# EAGLE design OMHOT (EAGLE 9.5.1)

## Sheet 1 of 2
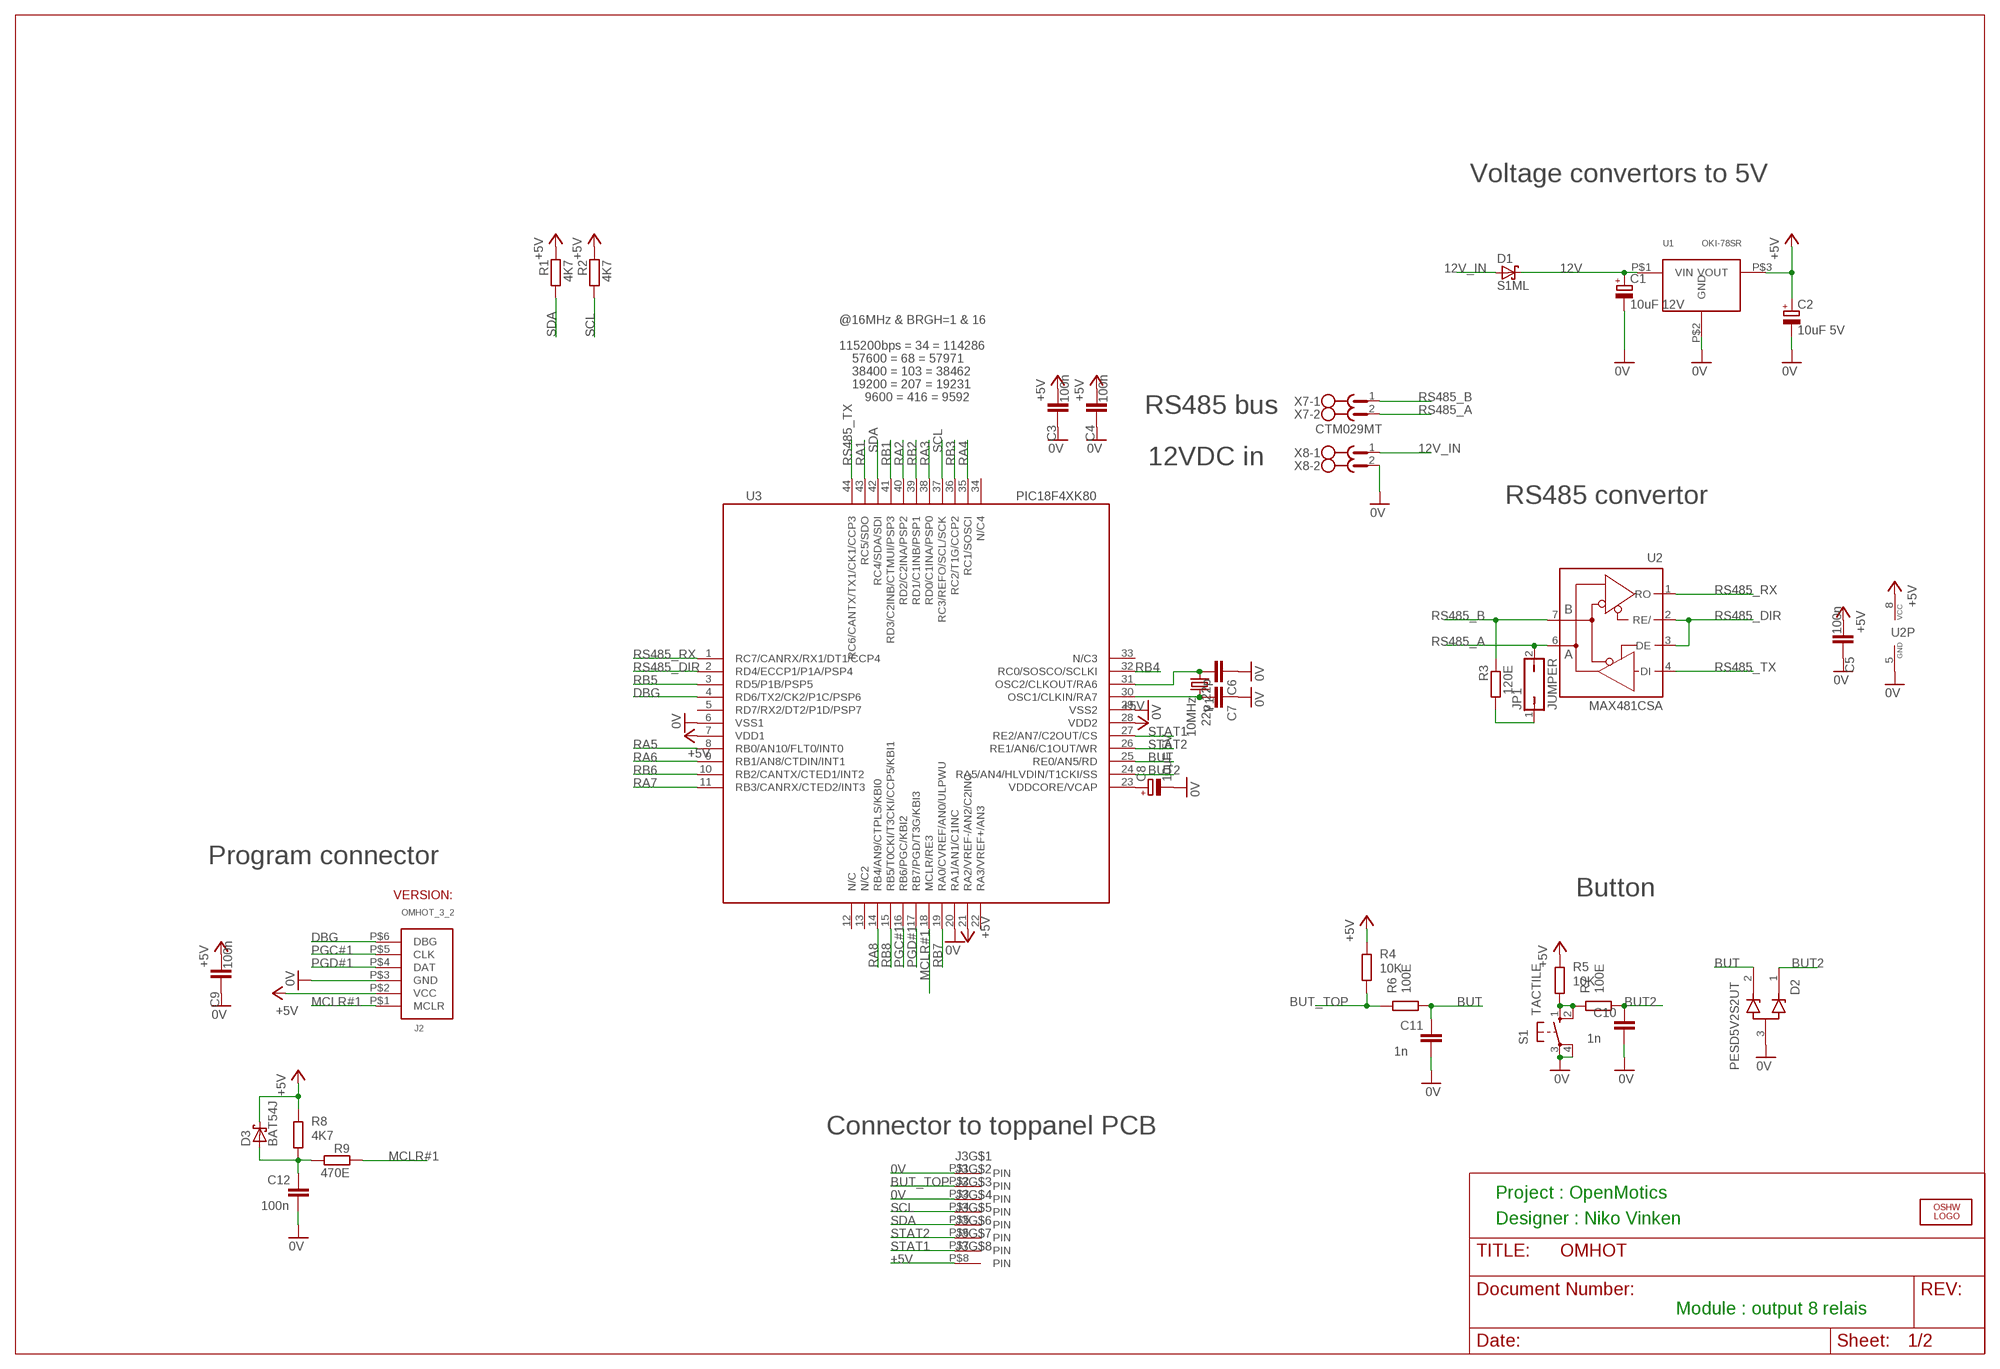
[diagram p0: schematic, sheet 1]

### Parts
C1  10uF 12V  CPOL-EU085CS-1AR  [085CS_1AR]
C2  10uF 5V  CPOL-EU085CS-1AR  [085CS_1AR]
C3  100n  C-EUC0603  [C0603]
C4  100n  C-EUC0603  [C0603]
C5  100n  C-EUC0603  [C0603]
C6  22p  C-EUC0603  [C0603]
C7  22p  C-EUC0603  [C0603]
C8  10uF 5V  CPOL-EU085CS-1AR  [085CS_1AR]
C9  100n  C-EUC0603  [C0603]
C10  1n  C-EUC0603  [C0603]
C11  1n  C-EUC0603  [C0603]
C12  100n  C-EUC0603  [C0603]
D1  S1ML  SMF5.0AT1  [SOD123FL]
D2  PESD5V2S2UT  PESD3V3S2UAT  [SOT23]
D3  BAT54J  [SOD323_REFLOW]
J2  PROG_CON  [PROG_CON_WITH_VERSION]
J3  8PIN_CON_AMP  [8PIN_CON_AMP]
JP1  JUMPER  JP1Q  [JP1]
LOGO2  OSHW_LOGO_FILLX0150-NT  [OSHW_FILLX150_NOTEXT]
R1  4K7  R-EU_R0603  [R0603]
R2  4K7  R-EU_R0603  [R0603]
R3  120E  R-EU_R1206  [R1206]
R4  10K  R-EU_R0603  [R0603]
R5  10K  R-EU_R0603  [R0603]
R6  100E  R-EU_R0603  [R0603]
R7  100E  R-EU_R0603  [R0603]
R8  4K7  R-EU_R0603  [R0603]
R9  470E  R-EU_R0603  [R0603]
S1  TACTILE  10-XX  [B3F-10XX]
U1  OKI-78SR  [OKI-78SR]
U2  MAX481CSA  [SO08]
U3  PIC18F4XK80  [TQFP44]
X7  CTM029MT  [CTM029MT]
X8  CTM029MT  [CTM029MT]
Y1  10MHz  CRYSTALSM49  [SM49]

### Nets
0V: C1.- C2.- C3.2 C4.2 C5.2 C6.1 C7.1 C8.- C9.2 C10.1 C11.1 C12.1 D2.3 J2.P$3(GND) J3.P$1 J3.P$3 S1.3(P) S1.4(P1) U1.P$2(GND) U2.5(GND) U3.6(VSS1) U3.20(RA1/AN1/C1INC) U3.29(VSS2) X8.2 ; also sheet 2
12V: C1.+ D1.C U1.P$1(VIN)
12V_IN: D1.A X8.1
+5V: C2.+ C3.1 C4.1 C5.1 C9.1 D3.1 J2.P$2(VCC) J3.P$8 R1.1 R2.1 R4.2 R5.2 R8.2 U1.P$3(VOUT) U2.8(VCC) U3.7(VDD1) U3.21(RA2/VREF-/AN2/C2INC) U3.28(VDD2) ; also sheet 2
BUT: C11.2 D2.2 R6.1 U3.25(RE0/AN5/RD)
BUT2: C10.2 D2.1 R7.1 U3.24(RA5/AN4/HLVDIN/T1CKI/SS)
BUT3: R5.1 R7.2 S1.1(S) S1.2(S1)
BUT_TOP: J3.P$2 R4.1 R6.2
DBG: J2.P$6(DBG) U3.4(RD6/TX2/CK2/P1C/PSP6)
MCLR#1: J2.P$1(MCLR) R9.1 U3.18(MCLR/RE3)
N$30: C6.2 U3.31(OSC2/CLKOUT/RA6) Y1.1
N$32: C7.2 U3.30(OSC1/CLKIN/RA7) Y1.2
N$33: C8.+ U3.23(VDDCORE/VCAP)
N$36: JP1.1 R3.2
N$444: C12.2 D3.2 R8.1 R9.2
PGC#1: J2.P$5(CLK) U3.16(RB6/PGC/KBI2)
PGD#1: J2.P$4(DAT) U3.17(RB7/PGD/T3G/KBI3)
RA1: U3.43(RC5/SDO) ; also sheet 2
RA2: U3.40(RD2/C2INA/PSP2) ; also sheet 2
RA3: U3.38(RD0/C1INA/PSP0) ; also sheet 2
RA4: U3.35(RC1/SOSCI) ; also sheet 2
RA5: U3.8(RB0/AN10/FLT0/INT0) ; also sheet 2
RA6: U3.9(RB1/AN8/CTDIN/INT1) ; also sheet 2
RA7: U3.11(RB3/CANRX/CTED2/INT3) ; also sheet 2
RA8: U3.14(RB4/AN9/CTPLS/KBI0) ; also sheet 2
RB1: U3.41(RD3/C2INB/CTMUI/PSP3) ; also sheet 2
RB2: U3.39(RD1/C1INB/PSP1) ; also sheet 2
RB3: U3.36(RC2/T1G/CCP2) ; also sheet 2
RB4: U3.32(RC0/SOSCO/SCLKI) ; also sheet 2
RB5: U3.3(RD5/P1B/PSP5) ; also sheet 2
RB6: U3.10(RB2/CANTX/CTED1/INT2) ; also sheet 2
RB7: U3.19(RA0/CVREF/AN0/ULPWU) ; also sheet 2
RB8: U3.15(RB5/T0CKI/T3CKI/CCP5/KBI1) ; also sheet 2
RS485_A: JP1.2 U2.6(A) X7.2
RS485_B: R3.1 U2.7(B) X7.1
RS485_DIR: U2.2(RE/) U2.3(DE) U3.2(RD4/ECCP1/P1A/PSP4)
RS485_RX: U2.1(RO) U3.1(RC7/CANRX/RX1/DT1/CCP4)
RS485_TX: U2.4(DI) U3.44(RC6/CANTX/TX1/CK1/CCP3)
SCL: J3.P$4 R2.2 U3.37(RC3/REFO/SCL/SCK)
SDA: J3.P$5 R1.2 U3.42(RC4/SDA/SDI)
STAT1: J3.P$7 U3.27(RE2/AN7/C2OUT/CS)
STAT2: J3.P$6 U3.26(RE1/AN6/C1OUT/WR)
Unconnected: U3.5(RD7/RX2/DT2/P1D/PSP7) U3.12(N/C) U3.13(N/C2) U3.22(RA3/VREF+/AN3) U3.33(N/C3) U3.34(N/C4)

### Notes on the sheet
- Voltage convertors to 5V
- @16MHz & BRGH=1 & 16
- 115200bps = 34 = 114286
- 57600 = 68 = 57971
- 38400 = 103 = 38462
- 19200 = 207 = 19231
- 9600 = 416 = 9592
- RS485 bus
- 12VDC in
- RS485 convertor
- Program connector
- Button
- Connector to toppanel PCB
- Project : OpenMotics
- Designer : Niko Vinken
- Module : output 8 relais

## Sheet 2 of 2
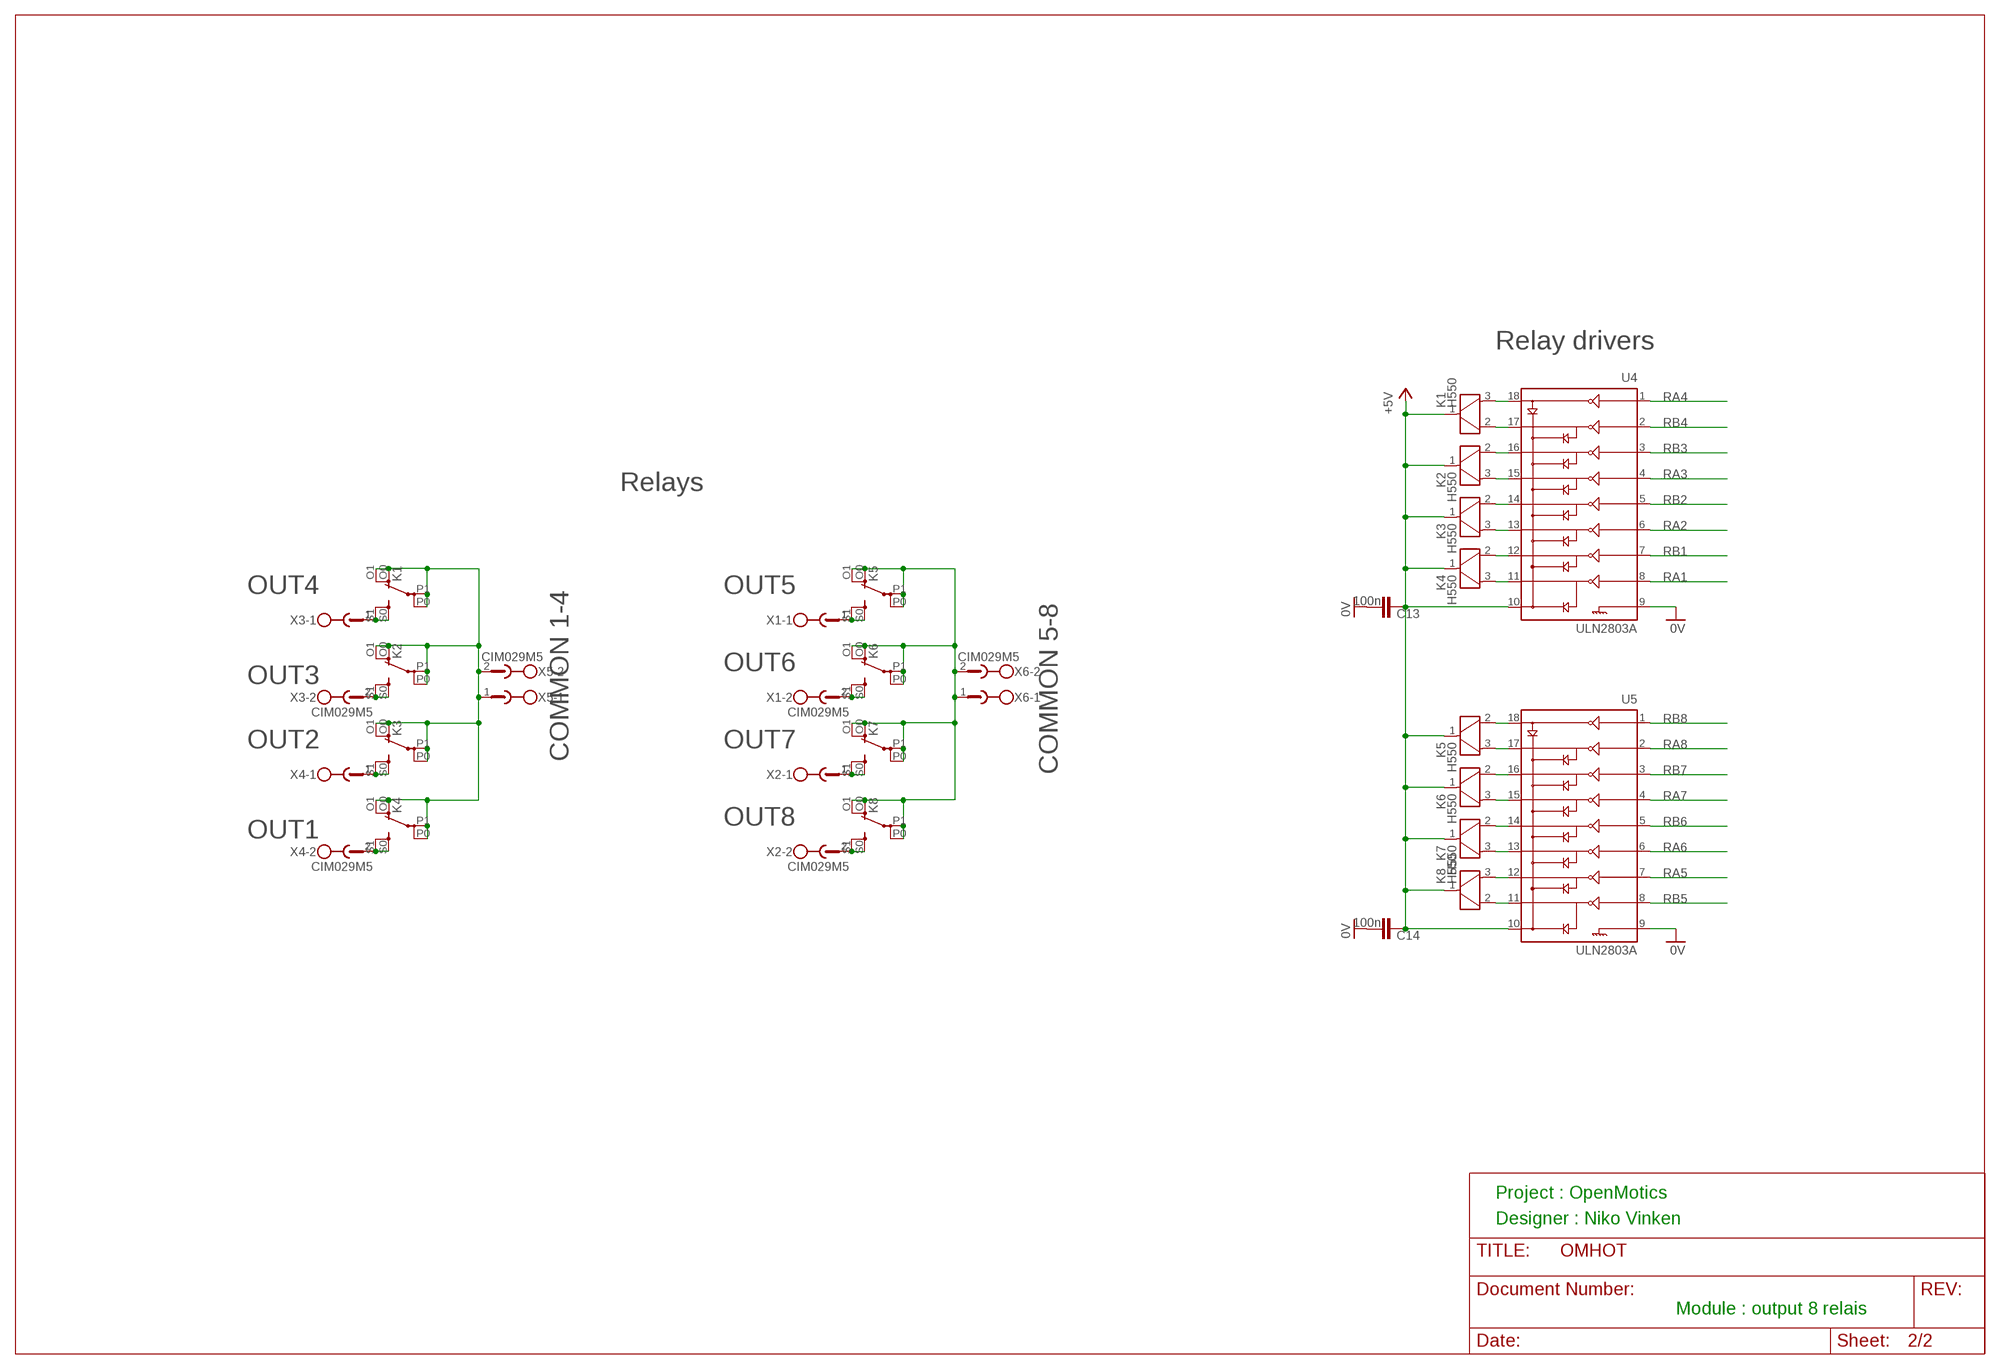
[diagram p1: schematic, sheet 2]

### Parts
C13  100n  C-EUC0603  [C0603]
C14  100n  C-EUC0603  [C0603]
K1  H550  [H550]
K2  H550  [H550]
K3  H550  [H550]
K4  H550  [H550]
K5  H550  [H550]
K6  H550  [H550]
K7  H550  [H550]
K8  H550  [H550]
U4  ULN2803A  [SOIC18]
U5  ULN2803A  [SOIC18]
X1  CIM029M5  [CIM029M5]
X2  CIM029M5  [CIM029M5]
X3  CIM029M5  [CIM029M5]
X4  CIM029M5  [CIM029M5]
X5  CIM029M5  [CIM029M5]
X6  CIM029M5  [CIM029M5]

### Nets
0V: C13.1 C14.1 U4.9 U5.9 ; also sheet 1
+5V: C13.2 C14.2 K1.1 K2.1 K3.1 K4.1 K5.1 K6.1 K7.1 K8.1 U4.10 U5.10 ; also sheet 1
N$1: K5.S0(2:S) K5.S1(2:S) X1.1
N$3: K3.S0(2:S) K3.S1(2:S) X4.1
N$4: K4.S0(2:S) K4.S1(2:S) X4.2
N$5: K6.S0(2:S) K6.S1(2:S) X1.2
N$6: K4.3 U4.11
N$7: K4.2 U4.12
N$8: K1.S0(2:S) K1.S1(2:S) X3.1
N$9: K3.3 U4.13
N$10: K7.S0(2:S) K7.S1(2:S) X2.1
N$11: K8.S0(2:S) K8.S1(2:S) X2.2
N$12: K1.O0(2:O) K1.O1(2:O) K1.P0(2:P) K1.P1(2:P) K2.O0(2:O) K2.O1(2:O) K2.P0(2:P) K2.P1(2:P) K3.O0(2:O) K3.O1(2:O) K3.P0(2:P) K3.P1(2:P) K4.O0(2:O) K4.O1(2:O) K4.P0(2:P) K4.P1(2:P) X5.1 X5.2
N$13: K2.S0(2:S) K2.S1(2:S) X3.2
N$14: K3.2 U4.14
N$15: K2.3 U4.15
N$16: K2.2 U4.16
N$17: K1.3 U4.18
N$18: K1.2 U4.17
N$19: K5.3 U5.17
N$20: K5.O0(2:O) K5.O1(2:O) K5.P0(2:P) K5.P1(2:P) K6.O0(2:O) K6.O1(2:O) K6.P0(2:P) K6.P1(2:P) K7.O0(2:O) K7.O1(2:O) K7.P0(2:P) K7.P1(2:P) K8.O0(2:O) K8.O1(2:O) K8.P0(2:P) K8.P1(2:P) X6.1 X6.2
N$21: K5.2 U5.18
N$22: K6.3 U5.15
N$23: K6.2 U5.16
N$24: K7.3 U5.13
N$25: K7.2 U5.14
N$26: K8.3 U5.12
N$27: K8.2 U5.11
RA1: U4.8 ; also sheet 1
RA2: U4.6 ; also sheet 1
RA3: U4.4 ; also sheet 1
RA4: U4.1 ; also sheet 1
RA5: U5.7 ; also sheet 1
RA6: U5.6 ; also sheet 1
RA7: U5.4 ; also sheet 1
RA8: U5.2 ; also sheet 1
RB1: U4.7 ; also sheet 1
RB2: U4.5 ; also sheet 1
RB3: U4.3 ; also sheet 1
RB4: U4.2 ; also sheet 1
RB5: U5.8 ; also sheet 1
RB6: U5.5 ; also sheet 1
RB7: U5.3 ; also sheet 1
RB8: U5.1 ; also sheet 1

### Notes on the sheet
- Relay drivers
- Relays
- OUT4 | OUT5
- OUT6
- OUT3
- OUT2 | OUT7
- COMMON 1-4
- COMMON 5-8
- OUT8
- OUT1
- Project : OpenMotics
- Designer : Niko Vinken
- Module : output 8 relais

## Library data of the parts
C1 C2 C8 = resistor:CPOL-EU: POLARIZED CAPACITOR, European symbol
C3-C7 C9-C14 = resistor:C-EU: CAPACITOR, European symbol
D1 = diode:SMF5.0AT1: 200 W Transient Voltage Suppressor Source: Data sheet <http://www.onsemi.com/pub_link/Collateral/SMF5.0AT1-D.PDF>
D2 = OpenMotics:PESD3V3S2UAT
D3 = OpenMotics:BAT54J
J2 = ruben:PROG_CON; VERSION: OMHOT_3_2
J3 = ruben:8PIN_CON_AMP
JP1 = jumper:JP1Q: JUMPER
K1-K8 = relay:H550: RELAY bistable, 1 x switch, high current; OC_FARNELL: unknown; OC_NEWARK: unknown
LOGO2 = ohw-logo:OSHW_LOGO_FILL
R1-R9 = resistor:R-EU_: RESISTOR, European symbol
S1 = switch-omron:10-XX: OMRON SWITCH; MPN: B3F-1000; OC_FARNELL: 176432; OC_NEWARK: 36M3542
U1 = OpenMotics:OKI-78SR
U2 = ruben:MAX481CSA: RS485 TRANSEIVER; MF: MAXIM; MPN: MAX481CSA; OC_FARNELL: unknown; OC_NEWARK: 90C3817
U3 = OpenMotics:PIC18F4XK80
U4 U5 = OpenMotics:ULN2803A
X1-X6 = ruben:CIM029M5: SAURO; MF: SAURO; MPN: CIM029M5
X7 X8 = ruben:CTM029MT: SAURO; MF: SAURO; MPN: CTM029MT
Y1 = crystal:CRYSTAL: CRYSTAL; OC_FARNELL: unknown; OC_NEWARK: unknown

## Board
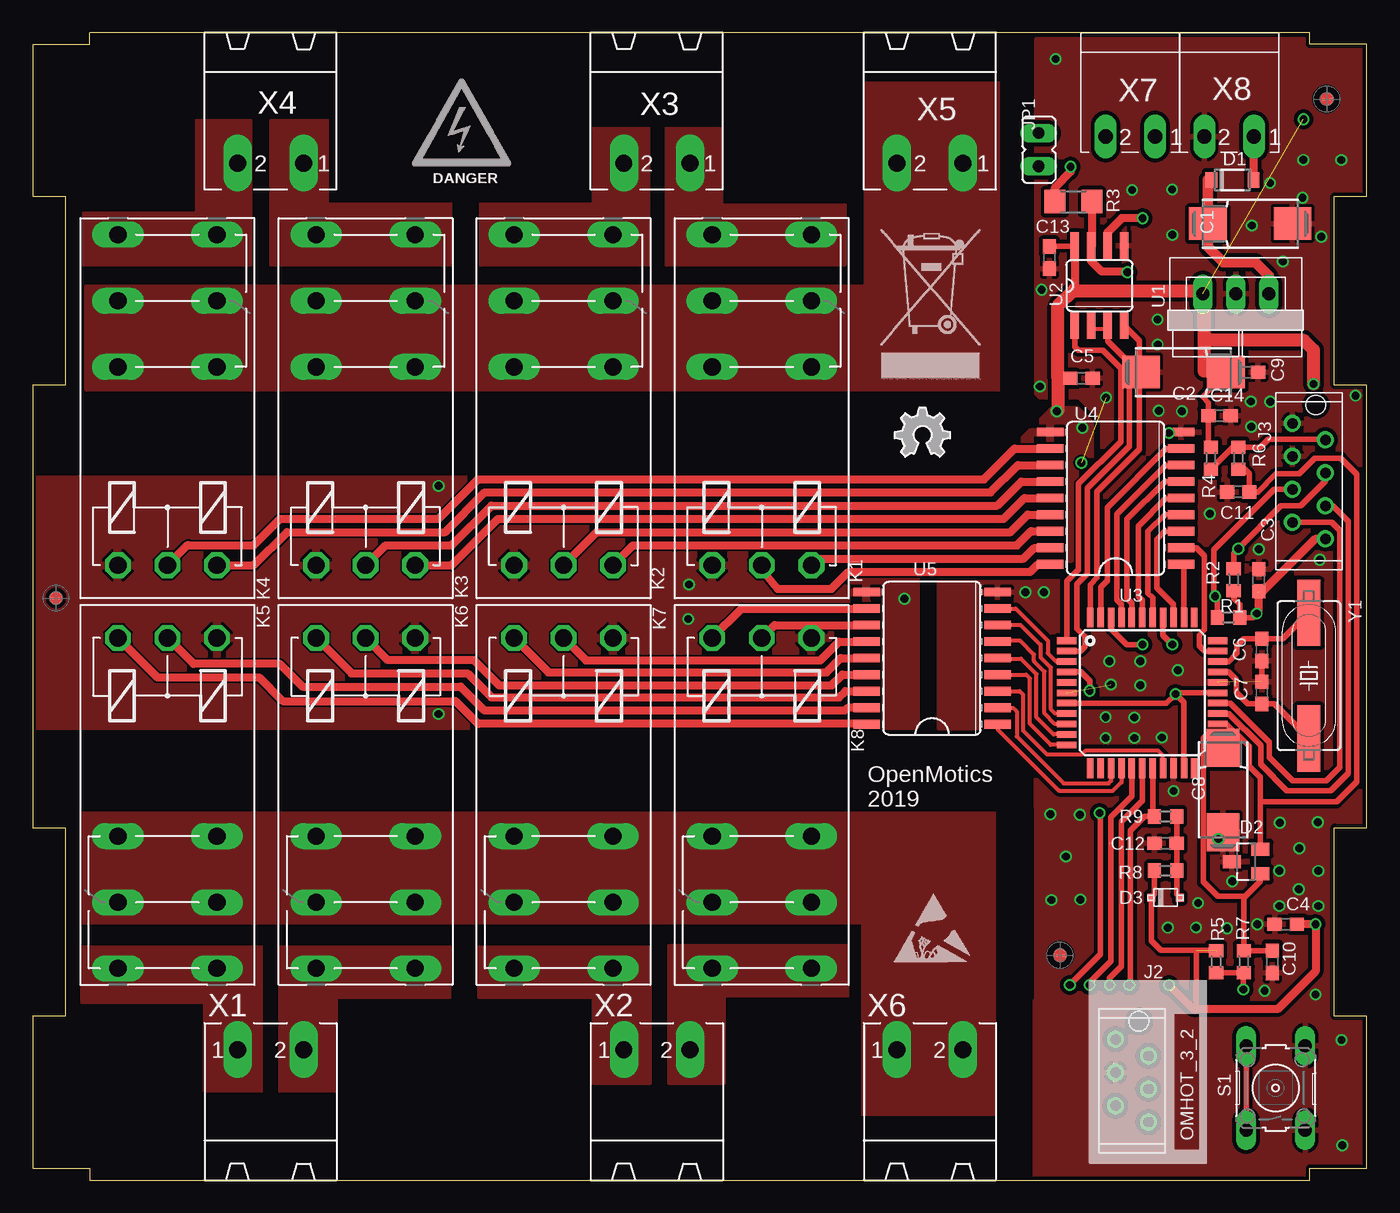
[diagram p2: board, top side]
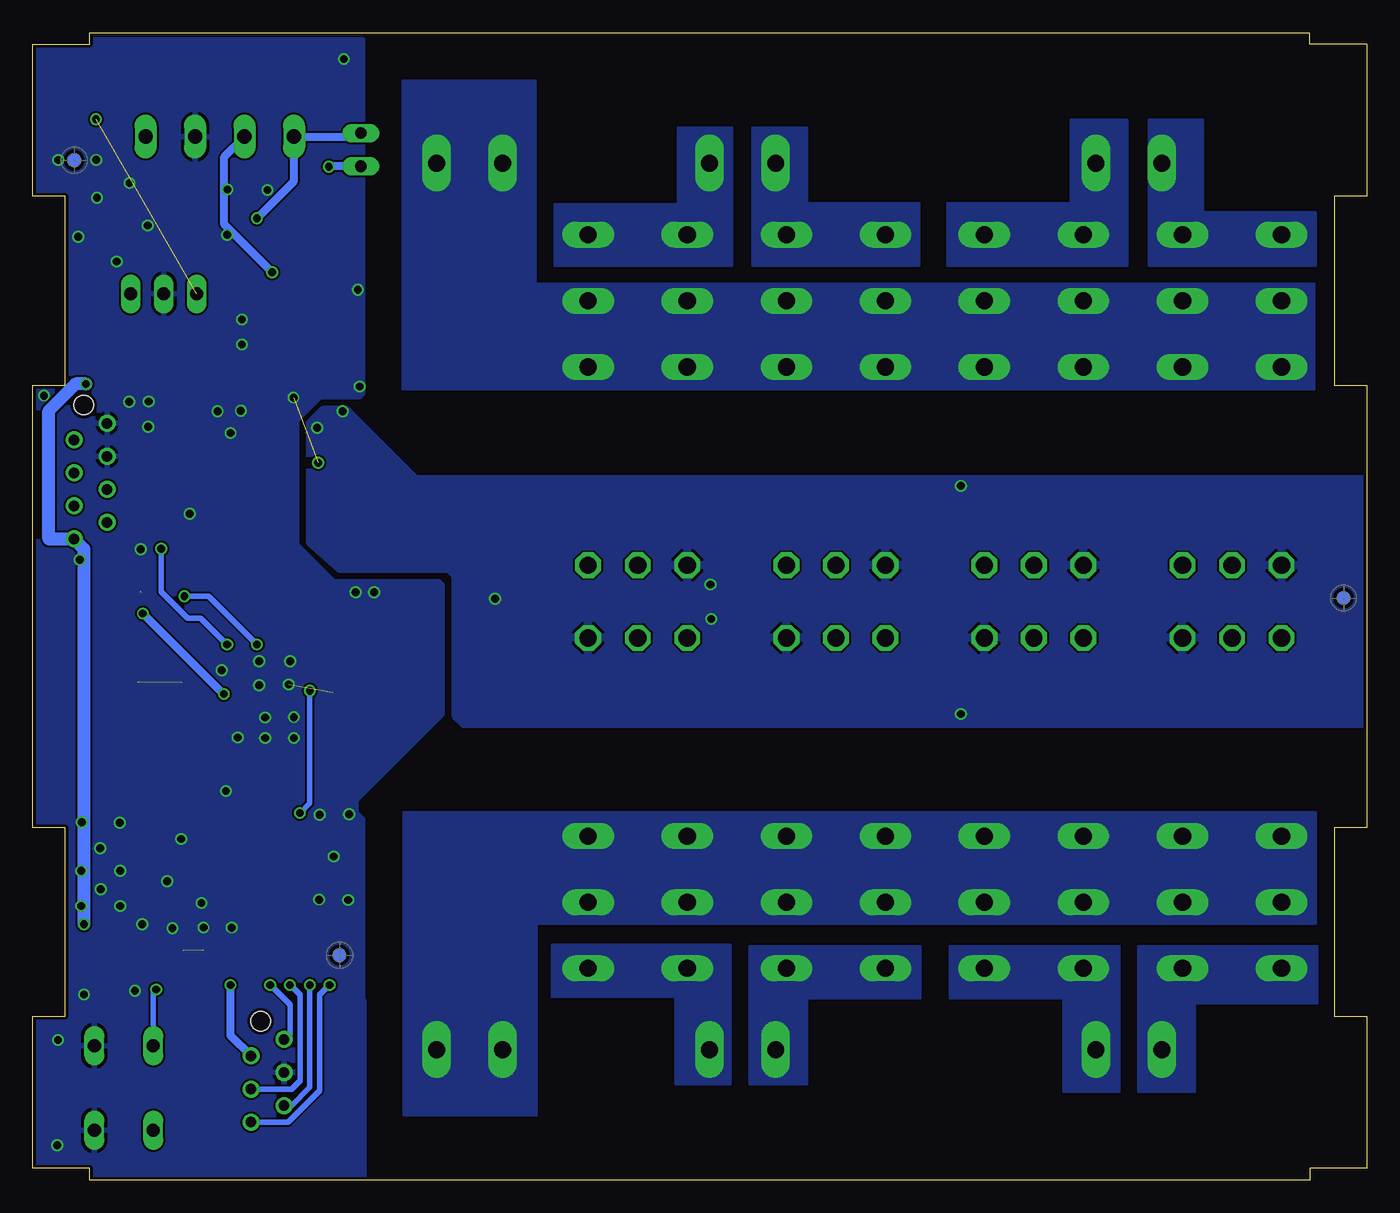
[diagram p3: board, bottom side, seen from below]

Size 102.6 x 88.2 mm. Coordinates in mm from the lower left corner, seen from the top.
Outline: 4.4,0 98.2,0 98.2,0.9 102.6,0.9 102.6,12.6 100.1,12.6 100.1,27.1 102.6,27.1 102.6,61.1 100.1,61.1 100.1,75.6 102.6,75.6 102.6,87.3 98.2,87.3 98.2,88.2 4.4,88.2 4.4,87.3 0,87.3 0,75.6 2.5,75.6 2.5,61.1 0,61.1 0,27.1 2.5,27.1 2.5,12.6 0,12.6 0,0.9 4.4,0.9 4.4,0
Copper layers (1*16): Top 0.035mm / dielectric 1.5mm / Bottom 0.035mm
Design rules "SeeedStudio_2layer_DRU_no_angle_20140221 *": minimum track width 6mil, minimum drill 12mil, track to track 6mil, track to pad 6mil, pad to pad 6mil, via to via 6mil, smd to smd 0mil, copper to edge 10mil, drill to drill 10mil, minimum pad ring 10mil, minimum via ring 6mil, stop-mask expansion 2mil, vias tented up to drill 100mil, thermal gap 10mil

### Footprints (pad centres in the part's own frame; a part is rotated, then mirrored left to right if it is on the bottom)
085CS_1AR = smd 2.9 x 2.5: + 3.25,0; - -3.25,0
C0603 = smd 1.1 x 1: 1 -0.85,0; 2 0.85,0
SOD123FL = smd 0.91 x 1.22: A 1.625,0; C -1.625,0
SOT23 = smd 1 x 1.4: 1 -0.95,-1.1; 2 0.95,-1.1; 3 0,1.1
SOD323_REFLOW = smd 0.6 x 0.6: 1 1.1,0; 2 -1.1,0
PROG_CON_WITH_VERSION = drill 0.8: P$1 0,0; P$2 -2.54,1.27; P$3 0,2.54; P$4 -2.54,3.81; P$5 0,5.08; P$6 -2.54,6.35 | hole 1.5: -1.8,-1.4
8PIN_CON_AMP = drill 0.8: P$1 0,0; P$2 1.27,2.54; P$3 2.54,0; P$4 3.81,2.54; P$5 5.08,0; P$6 6.35,2.54; P$7 7.62,0; P$8 8.89,2.54 | hole 1.5: -1.4,1.8
JP1 = drill 0.914 long: 1 0,-1.27; 2 0,1.27
H550 = drill 1.321 octagon: 1 -7.62,3.81; 2 -7.62,-3.81; 3 -7.62,0 | drill 1.321 long: O0 7.62,3.81; O1 7.62,-3.81; P0 12.7,3.81; P1 12.7,-3.81; S0 17.78,3.81; S1 17.78,-3.81
R0603 = smd 1 x 1.1: 1 -0.85,0; 2 0.85,0
R1206 = smd 1.6 x 1.803: 1 -1.422,0; 2 1.422,0
B3F-10XX = drill 1.016 long: 1 -3.251,2.261; 2 3.251,2.261; 3 -3.251,-2.261; 4 3.251,-2.261
OKI-78SR = drill 1 long: P$1 0,0; P$2 2.54,0; P$3 5.08,0
SO08 = smd 0.66 x 2.032: 1 -1.905,-3.073; 2 -0.635,-3.073; 3 0.635,-3.073; 4 1.905,-3.073; 5 1.905,3.073; 6 0.635,3.073; 7 -0.635,3.073; 8 -1.905,3.073
TQFP44 = smd 1.5 x 0.5: 1 -5.8,4; 2 -5.8,3.2; 3 -5.8,2.4; 4 -5.8,1.6; 5 -5.8,0.8; 6 -5.8,0; 7 -5.8,-0.8; 8 -5.8,-1.6; 9 -5.8,-2.4; 10 -5.8,-3.2; 11 -5.8,-4; 23 5.8,-4; 24 5.8,-3.2; 25 5.8,-2.4; 26 5.8,-1.6; 27 5.8,-0.8; 28 5.8,0; 29 5.8,0.8; 30 5.8,1.6; 31 5.8,2.4; 32 5.8,3.2; 33 5.8,4 | smd 0.5 x 1.5: 12 -4,-5.8; 13 -3.2,-5.8; 14 -2.4,-5.8; 15 -1.6,-5.8; 16 -0.8,-5.8; 17 0,-5.8; 18 0.8,-5.8; 19 1.6,-5.8; 20 2.4,-5.8; 21 3.2,-5.8; 22 4,-5.8; 34 4,5.8; 35 3.2,5.8; 36 2.4,5.8; 37 1.6,5.8; 38 0.8,5.8; 39 0,5.8; 40 -0.8,5.8; 41 -1.6,5.8; 42 -2.4,5.8; 43 -3.2,5.8; 44 -4,5.8
SOIC18 = smd 0.66 x 2.032: 1 1.27,0.051; 2 2.54,0.051; 3 3.81,0.051; 4 5.08,0.051; 5 6.35,0.051; 6 7.62,0.051; 7 8.89,0.051; 8 10.16,0.051; 9 11.43,0.051; 10 11.43,10.109; 11 10.16,10.109; 12 8.89,10.109; 13 7.62,10.109; 14 6.35,10.109; 15 5.08,10.109; 16 3.81,10.109; 17 2.54,10.109; 18 1.27,10.109
CIM029M5 = drill 1.3 pad 2.2 long: 1 -2.54,10.033; 2 2.54,10.033
CTM029MT = drill 1.1 pad 1.7 long: 1 -1.905,8; 2 1.905,8
SM49 = smd 5.08 x 1.778: 1 -4.826,0; 2 4.826,0

### Placement (x,y rotation side)
C1  93.62,73.51 180 top
C2  88.49,62.09 0 top
C3  94.27,46.11 90 top
C4  96.35,19.67 180 top
C5  80.64,61.61 0 top
C6  94.52,40.76 90 top
C7  94.52,37.45 270 top
C8  91.53,29.99 90 top
C9  93.36,62.09 0 top
C10  95.32,16.78 90 top
C11  92.7,52.89 0 top
C12  87.11,25.88 0 top
C13  78.18,70.91 90 top
C14  91.26,58.75 180 top
D1  92.25,76.87 0 top
D2  93.3,24.49 90 top
D3  87.11,21.71 180 top
J2  83.26,10.81 180 top
J3  96.87,58.17 270 top
JP1  77.36,79.21 0 top
K1  56.07,54.88 90 top
K2  40.83,54.88 90 top
K3  25.61,54.88 90 top
K4  10.37,54.88 90 top
K5  10.37,34.05 270 top
K6  25.61,34.05 270 top
K7  40.83,34.05 270 top
K8  56.07,34.05 270 top
LOGO2  66.3,55.59 0 top
R1  91.96,43.24 180 top
R2  92.35,46.14 90 top
R3  80.03,75.2 180 top
R4  90.6,55.49 90 top
R5  91,16.78 90 top
R6  92.7,55.49 90 top
R7  93.13,16.78 270 top
R8  87.11,23.78 180 top
R9  87.11,27.96 0 top
S1  95.58,7.08 90 top
U1  95.04,68.11 180 top
U2  82.04,68.75 0 top
U3  85.32,37.45 0 top
U4  88.35,46.06 90 top
U5  74.24,33.76 90 top
U$1  [FIDUCIAL_G10]  99.4,78.39 0 bottom
U$2  [FIDUCIAL_G10]  79,17.29 0 top
U$3  [FIDUCIAL_G10]  99.5,83.09 0 top
U$4  CNMB/6  [CNMB/6-]  104.23,-0.46 0 top
U$5  [FIDUCIAL_G10]  1.8,44.74 0 top
U$6  [FIDUCIAL_G10]  1.8,44.74 0 bottom
U$8  DISPOSAL-SYMBOL  [DISPOSAL]  65.2,61.69 0 top
U$10  [ESD]  66,16.49 0 top
U$11  [HIGH-VOLTAGE]  29.2,77.49 0 top
U$12  [FIDUCIAL_G10]  79,17.29 0 bottom
X1  18.3,0 0 top
X2  48,0 0 top
X3  48,88.2 180 top
X4  18.3,88.2 180 top
X5  69,88.2 180 top
X6  69,0 0 top
X7  84.4,88.2 180 top
X8  92,88.2 180 top
Y1  98.13,38.77 270 top

### Tracks (layer width: path | path; a pad name or v marks a point on that pad's centre or on a via)
0V  (via drill 0.6)  (3 unrouted)
  Top 0.406: C6.1 C7.1
  other vias: 88.38,59.09 87.38,57.42 86.59,59.13 84.54,76.1 87.61,76.13 77.59,68.42 77.45,61 82.53,60.14 85.18,39.88 88.05,39.19 91.16,26.21 98.81,27.49 89.45,19.41 89.62,21.3 100.71,2.68 77.77,45.18 76.34,45.18 94.29,48.49 94.72,14.55 94.17,19.67 95.86,23.77 91.84,19.35 98.85,21.07 78.33,21.52 80.52,28.08 78.26,28.11 82.5,33.99 86.83,34.02 82.8,39.89 85.18,38.04 98.96,47.68 78.66,86.16 95.91,27.46 79.45,24.88 90.52,51.21 95.17,59.82 97.65,75.5 87.64,72.65 80.63,55.13 86.51,64.23 87.3,19.41 98.85,23.77 92.25,22.96 95.85,21.07 97.4,25.52 97.35,22.37 98.65,14.26 93.71,57.89 86.49,66.15 101.72,60.3 93.67,59.84 96.13,70.6 97.71,78.41 99.08,72.51 95.15,76.64 93.75,73.37 100.61,78.4 100.65,10.78 82.5,35.59 84.72,35.55 84.72,33.98 87.72,29.91 80.55,21.56 82.9,38.09
  pour Top (isolate 0.305): 77.22,87.65 77.22,60.47 77.47,60.21 80.52,60.21 82.3,58.44 82.3,48.78 79.5,45.99 69.74,45.99 69.74,34.78 77.09,34.78 77.1,34.79 77.22,27.3 77.22,13.73 77.09,13.73 77.09,-0.56 102.87,-0.56 102.87,87.65
  pour Bottom: 77.22,87.65 77.22,60.47 77.47,60.21 80.52,60.21 82.3,58.44 82.3,48.78 79.5,45.99 71.37,45.99 71.12,45.74 71.12,35.83 77.72,29.23 77.72,28.21 77.22,27.7 77.22,13.73 77.09,13.73 77.09,-0.46 102.87,-0.46 102.87,87.65
12V
  Top 0.813: D1.C 90.37,76.87 C1.+ 90.37,71.72 91.55,70.54 94.02,70.54 95.04,69.52 U1.P$1
12V_IN
  Top 0.61: D1.A 93.88,76.73 93.91,76.7 X8.1
+5V  (via drill 0.6)  (3 unrouted)
  Top 0.406: R5.2 91,17.68 89.49,17.68 89.49,13.14 | C13.2 80.07,71.76 U2.8 | R8.2 86.26,21.96 D3.1 86.01,18.4 86.73,17.68 89.47,17.68 | U3.7 87.18,36.65 v87.88,37.35 | U3.28 87.98,37.45 v87.88,37.35 | C14.2 90.41,58.55 | 90.41,58.55 | 90.39,56.54 R4.2 90.41,56.52 90.41,58.55 | R2.1 92.35,44.69 92.81,44.24 R1.1 93.82,43.24 v94.12,43.54 | C2.+ 89.97,60.19 90.41,59.75 C14.2 | 90.31,58.85 C14.2 | v87.88,37.35 88.52,36.72 U3.21 | C5.1 79.77,61.59 78.85,61.59
  Top 0.61: U2.8 80.13,68.44 | J3.P$8 98.63,49.28 94.61,45.26 C3.1 | C4.1 v98.65,19.67 98.65,16.05 95.74,13.14 89.49,13.14 89.24,13.14 v87.38,15 | C9.1 C2.+ | 94.26,45.19 94.26,43.69 v94.12,43.54
  Top 1.016: v78.75,59.1 78.85,59.2 78.85,61.59 78.85,67.19 80.1,68.44 80.13,68.44 80.23,68.34 89.74,68.34 U1.P$3 89.96,67.69 90.07,67.59 90.07,64.99 | v98.48,61.19 v98.48,61.2 98.48,63.81 97.75,64.53 90.53,64.53 90.07,64.99 | 90.07,64.99 90.07,62.19 C2.+
  Bottom 0.61: v94.12,43.54 94.07,43.54 v87.88,37.35 | J2.P$2 87.38,11.11 v87.38,15
  Bottom 1.016: v98.65,19.67 98.65,48.52 J3.P$8 101.35,49.28 101.35,59.13 99.28,61.19 v98.48,61.19
  other vias: 97.72,81.53 80.73,57.83 50.42,43.12 31.22,53.36 31.22,35.83 67.04,44.68 50.47,45.78
  pour Bottom: 0.25,53.86 73.15,53.86 78.49,59.2 80.26,59.2 81.28,58.18 81.28,49.04 78.99,47.01 70.61,47.01 70.1,46.5 70.1,35.7 69.47,35.07 0.25,35.07
  pour Top: 0.25,53.86 73.15,53.86 78.49,59.2 80.26,59.2 81.28,58.18 81.28,49.04 78.99,47.01 67.87,47.01 67.87,34.87 0.25,34.87
BUT
  Top 0.406: 94.4,29.07 100.27,29.07 101.83,30.62 101.83,54.26 100.6,55.49 98.6,55.49 97.4,54.29 95.6,54.29 94.2,52.89 C11.2 93.55,54.29 93.2,54.64 R6.1 | D2.2 94.4,29.07 | 94.4,29.07 94.4,30.96 93.56,31.8 93.56,33.34 91.84,35.05 U3.25
BUT2
  Top 0.406: 95.29,17.66 C10.2 R7.1 93.13,21.71 93.23,21.81 | D2.1 94.4,22.99 93.23,21.81 | U3.24 90.31,34.25 90.01,33.95 90.01,22.93 91.13,21.81 93.23,21.81
BUT3  (via drill 0.6)
  Top 0.406: S1.1 S1.2 | R5.1 R7.2 93.1,15.91 93.1,15.83 93.1,15.82 v93.1,14.66
  Bottom 0.406: v93.1,14.66 93.32,14.43 S1.2
BUT_TOP
  Top 0.406: J3.P$2 99.37,56.94 95,56.94 94.4,56.34 R6.2 92.3,56.34 R4.1
DBG  (via drill 0.6)
  Top 0.406: U3.4 80.6,39.05 81.28,38.37 v81.28,37.61 | v82.04,28.21 82.1,28.16 82.1,17.34 v79.76,15
  Bottom 0.406: v81.28,37.61 81.28,28.97 v82.04,28.21 | v79.76,15 80.52,14.24 80.52,6.87 82.93,4.46 J2.P$6
MCLR#1  (via drill 0.6)
  Top 0.406: U3.18 86.12,27.96 R9.1 85.52,27.96 84.4,26.84 84.4,15.07 v84.33,15
  Bottom 0.406: J2.P$1 83.19,10.81 82.8,11.19 82.8,13.48 v84.33,15
N$1
  pour Top (no thermals): 3.8,17.99 17.6,17.99 17.6,6.79 13.2,6.79 13.2,13.59 3.8,13.59
  pour Bottom (no thermals): 3.8,17.99 17.6,17.99 17.6,6.79 13.2,6.79 13.2,13.59 3.8,13.59
N$3
  pour Top (no thermals): 18.3,81.49 22.7,81.49 22.7,75.09 32.2,75.09 32.2,70.29 18.3,70.29
  pour Bottom (no thermals): 18.4,81.49 22.8,81.49 22.8,75.09 32.3,75.09 32.3,70.29 18.4,70.29
N$4
  pour Bottom (no thermals): 13.83,72.66 arc-90 13.07,71.9
  pour Top (no thermals): 15.96,72.66 arc-90 15.2,71.9
  pour Top (isolate 0.254, no thermals): 3.9,74.39 12.6,74.39 12.6,80.09 12.6,81.49 16.8,81.49 16.8,70.29 3.9,70.29
  pour Bottom (isolate 0.254, no thermals): 3.9,74.39 12.6,74.39 12.6,80.09 12.6,81.49 16.8,81.49 16.8,70.29 3.9,70.29
N$5
  pour Top (no thermals): 19,6.79 19,17.99 32.1,17.99 32.1,13.99 23.4,13.99 23.4,6.79
  pour Bottom (no thermals): 19,6.79 19,17.99 32.1,17.99 32.1,13.99 23.4,13.99 23.4,6.79
N$6
  Top 0.61: K4.3 11.93,48.82 11.99,48.78 17.02,48.78 19.05,50.82 31.22,50.82 34.27,53.86 73.15,53.86 75.51,56.22 U4.11
N$7
  Top 0.61: K4.2 17.02,47.26 19.56,49.8 31.73,49.8 34.77,52.85 73.66,52.85 75.76,54.95 U4.12
N$8
  pour Bottom (no thermals): 51.27,71.9 50.51,72.66 arc35
  pour Top (no thermals): 48.7,80.89 53,80.89 53,74.99 62.5,74.99 62.5,70.29 48.7,70.29
  pour Bottom (no thermals): 48.8,80.89 53,80.89 53,74.99 62.5,74.99 62.5,70.29 48.8,70.29
N$9
  Top 0.61: K3.3 27.11,48.75 27.13,48.78 32.23,48.78 35.28,51.83 74.17,51.83 76.02,53.68 U4.13
N$10
  pour Bottom (no thermals): 46.44,16.27 arc-53 46.19,15.76 arc46
  pour Top (no thermals): 36.79,17.03 36.03,16.27 arc-90
  pour Top (no thermals): 34.3,17.99 47.5,17.99 47.5,7.39 43.1,7.39 43.1,13.99 34.3,13.99
  pour Bottom (no thermals): 34.3,17.99 47.5,17.99 47.5,7.39 43,7.39 43,13.99 34.3,13.99
N$11
  pour Top (no thermals): 48.9,7.39 48.9,18.09 62.7,18.09 62.7,14.09 53.2,14.09 53.2,7.39
  pour Bottom (no thermals): 48.9,7.39 48.9,18.09 62.7,18.09 62.7,14.09 53.2,14.09 53.2,7.39
N$12
  pour Bottom (no thermals): 4,68.89 63.9,68.89 63.9,84.49 74.2,84.49 74.2,60.79 4,60.79
  pour Top (no thermals): 4.1,68.79 64,68.79 64,84.39 74.3,84.39 74.3,60.69 4.1,60.69
N$13
  pour Bottom (no thermals): 45.68,71.9 arc90 46.44,72.66 arc53 46.19,73.17 arc-46
  pour Top (no thermals): 34.4,75.09 43.1,75.09 43.1,80.89 47.4,80.89 47.4,70.29 34.4,70.29
  pour Bottom (no thermals): 34.4,75.09 43,75.09 43,80.89 47.3,80.89 47.3,70.29 34.4,70.29
N$14
  Top 0.61: K3.2 32.23,47.26 35.79,50.82 74.68,50.82 76.27,52.41 U4.14
N$15
  Top 0.61: K2.3 43.37,49.8 75.18,49.8 76.52,51.14 U4.15
N$16
  Top 0.61: K2.2 46.16,48.78 75.69,48.78 76.78,49.87 U4.16
N$17
  Top 0.61: K1.3 56.07,46.91 57.28,45.44 61.43,45.44 62.74,46.75 76.71,46.75 77.29,47.33 U4.18
N$18
  Top 0.61: K1.2 59.88,47.77 76.2,47.77 77.03,48.6 U4.17
N$19
  Top 0.61: K5.3 12.37,39.67 19.02,39.67 20.76,37.93 32.93,37.93 34.77,36.08 62.45,36.08 62.67,36.3 U5.17
N$20
  pour Bottom (no thermals): 3.9,28.29 74.1,28.29 74.1,4.99 63.8,4.99 63.8,19.69 3.9,19.69
  pour Top (no thermals): 3.8,28.29 74,28.29 74,4.99 63.8,4.99 63.8,19.69 3.8,19.69
N$21
  Top 0.61: K5.2 9.59,38.65 17.42,38.65 19.25,36.82 32.52,36.82 34.27,35.07 64.1,35.07 U5.18
N$22
  Top 0.61: K6.3 27.31,39.97 33.93,39.97 35.89,38.02 61.43,38.02 62.26,38.84 U5.15
N$23
  Top 0.61: K6.2 24.53,38.95 33.43,38.95 35.28,37.1 62.01,37.1 62.49,37.57 U5.16
N$24
  Top 0.61: K7.3 42.55,39.95 60.56,39.95 62,41.38 U5.13
N$25
  Top 0.61: K7.2 39.66,39.03 61.05,39.03 62.13,40.11 U5.14
N$26
  Top 0.61: K8.3 57.05,42.65 U5.12
N$27
  Top 0.61: U5.11 54.51,43.92 K8.2
N$30
  Top 0.406: U3.31 91.97,39.85 92.6,40.49 92.6,41.09 93.12,41.61 C6.2 96.14,41.61 Y1.1
N$32
  Top 0.406: U3.30 91.96,39.05 92.55,38.46 92.55,37.5 93.44,36.6 C7.2 95.47,36.6 Y1.2
N$33
  Top 0.406: U3.23 91.53,33.04 C8.+
N$36  (via drill 0.6)
  Top 0.61: R3.2 78.61,76.28 79.81,77.48 v79.81,77.88
  Bottom 0.61: v79.81,77.88 79.76,77.94 JP1.1
N$444
  Top 0.406: R9.2 C12.2 R8.1 87.96,21.96 D3.2
PGC#1  (via drill 0.6)
  Top 0.406: v81.28,15 81.28,15.2 82.9,16.82 82.9,27.89 84.52,29.51 U3.16
  Bottom 0.406: J2.P$5 82.68,5.73 81.28,7.13 v81.28,15
PGD#1  (via drill 0.6)
  Top 0.406: v82.8,15 82.8,15.5 83.72,16.42 83.72,27.55 85.32,29.15 U3.17
  Bottom 0.406: J2.P$4 82.68,7 82.04,7.64 82.04,14.24 v82.8,15
RA1
  Top 0.406: U3.43 82.12,45.56 82.62,46.06 82.62,51.69 87.15,56.22 U4.8
RA2
  Top 0.406: U3.40 84.52,44.35 84.14,44.73 84.14,50.78 87.05,53.68 U4.6
RA3
  Top 0.406: U3.38 86.12,44.75 85.77,45.11 85.77,49.86 87.05,51.14 U4.4
RA4
  Top 0.406: U3.35 88.52,47.05 88.27,47.3 U4.1
RA5
  Top 0.305: U5.7 75.99,42.65 77.49,41.15 77.49,40.2 78.31,39.39 78.31,36.18 78.63,35.85 U3.8
RA6
  Top 0.305: U3.9 78.62,35.05 77.8,35.88 77.8,39.09 77,39.89 77,40.39 75.95,41.44 74.24,41.44 U5.6
RA7
  Top 0.305: U3.11 78.29,33.45 76.68,35.06 76.68,38.55 76.39,38.84 U5.4
RA8
  Top 0.305: U5.2 75.39,36.3 75.67,36.02 75.67,34.1 79.28,30.49 82.73,30.49 82.92,30.68 U3.14
RB1
  Top 0.406: U3.41 83.72,44.25 83.38,44.59 83.38,51.19 87.15,54.95 U4.7
RB2
  Top 0.406: U3.39 85.32,44.55 85.01,44.87 85.01,50.27 87.15,52.41 U4.5
RB3
  Top 0.406: U3.36 87.72,44.25 86.43,45.54 86.43,49.27 87.03,49.87 U4.3
RB4
  Top 0.406: U4.2 89.48,48.6 90.1,47.98 90.1,42.29 89.7,41.89 89.7,41.09 89.98,40.81 89.98,40.8 90.12,40.65 U3.32
RB5
  Top 0.305: U3.3 78.7,39.85 78.05,40.5 78.05,41.47 75.6,43.92 U5.8
RB6
  Top 0.305: U3.10 78.51,34.25 77.19,35.57 77.19,38.89 76,40.09 74.9,40.09
  Top 0.406: U5.5 74.22,40.09 74.9,40.09
RB7
  Top 0.305: U3.19 86.92,32.65 86.54,33.04 81,33.04 80.69,32.73 78,32.73 76.18,34.55 76.18,37.29 75.89,37.57 U5.3
RB8
  Top 0.305: U5.1 74.19,34.66 78.92,29.93 83.08,29.93 83.72,30.57 U3.15
RS485_A  (via drill 0.6)
  Top 0.61: v85.34,73.93 83.74,73.93 82.67,72.86 U2.6
  Bottom 0.61: X7.2 82.5,76.78 v85.34,73.93 | X7.2 82.3,80 | X7.2 77.36,80.2 JP1.2
RS485_B  (via drill 0.6)
  Top 0.61: 84.1,69.79 84.13,69.77 v84.17,69.77 84.12,69.82 82.2,69.82 81.4,70.62 U2.7 81.45,71.88 R3.1
  Bottom 0.61: v84.17,69.77 87.86,73.45 87.86,78.65 X7.1
RS485_DIR
  Top 0.305: 82.57,65.38 81.4,65.38 U2.2
  Top 0.406: U3.2 80.57,40.65 80.9,40.99 80.9,41.79 80.3,42.39 80.3,45.79 81.07,46.56 81.09,46.56 81.09,53.16 84.34,56.41 84.34,62.81 82.67,64.48 82.67,65.28 | U2.3 82.67,65.28 | 82.67,65.28 82.57,65.38
RS485_RX
  Top 0.406: U3.1 79.52,46.01 80.43,46.91 80.43,53.52 83.67,56.77 83.67,62.41 82.3,63.79 80.4,63.79 80.13,64.05 U2.1
RS485_TX
  Top 0.406: U3.44 81.32,45.78 81.85,46.31 81.85,52.91 85.1,56.16 85.1,64.52 U2.4
SCL  (via drill 0.6)
  Top 0.406: J3.P$4 99.41,53.69 97.53,51.82 95.99,51.82 v92.7,48.53 92.35,48.18 R2.2 | v87.63,41.16 86.92,41.87 U3.37
  Bottom 0.406: v92.7,48.53 92.7,45.23 90.67,43.2 89.66,43.2 v87.63,41.16
SDA  (via drill 0.6)
  Top 0.406: J3.P$5 95.49,53.09 90.84,48.44 90.84,44.96 v90.92,44.87 91.11,44.69 R1.2 | U3.42 82.92,42.37 84.12,41.16 v85.34,41.16
  Bottom 0.406: v90.92,44.87 89.05,44.87 v85.34,41.16
STAT1
  Top 0.406: U3.27 92.1,36.65 95.08,33.67 95.08,32.51 96.9,30.69 99.46,30.69 100.5,31.73 100.5,49.93 99.89,50.55 J3.P$7
STAT2
  Top 0.406: U3.26 91.98,35.85 94.42,33.42 94.42,31.95 96.44,29.93 99.82,29.93 101.17,31.28 101.17,50.64 99.99,51.82 J3.P$6

### Text on the board
tPlace: OpenMotics / 2019